# EAGLE schematic Durfee_Shutdown_Circuit_PCB_Design (EAGLE 9.7.0)
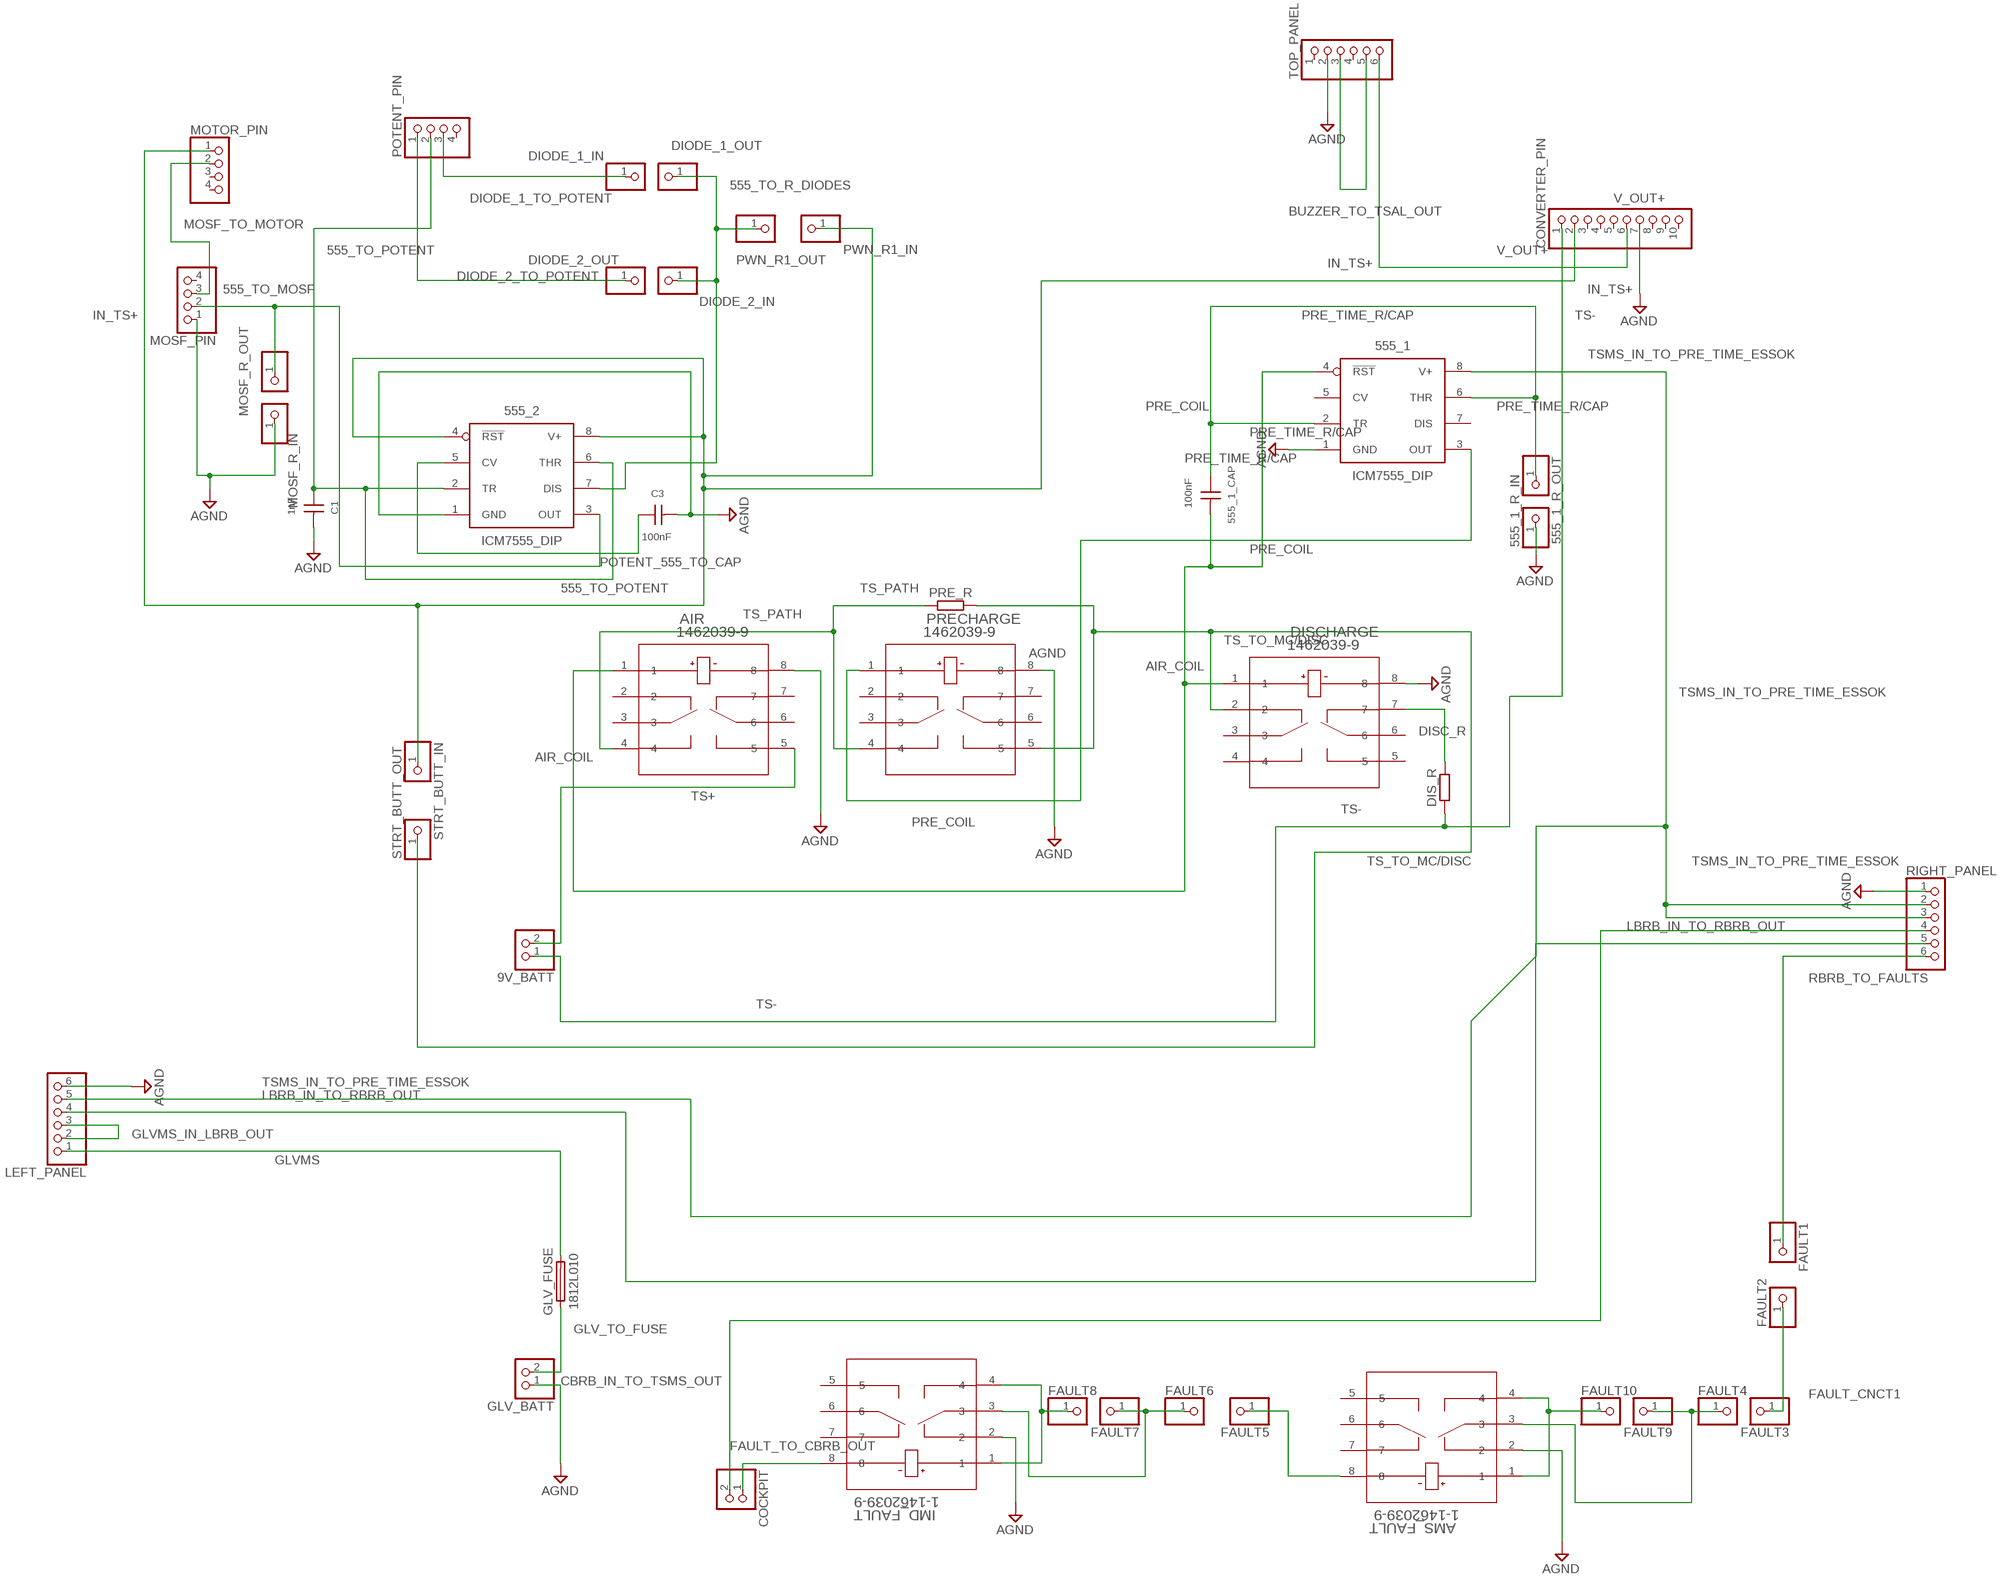
[diagram p0: schematic, sheet 1]

## Parts
9V_BATT  PINHD-1X2  [1X02]
555_1  ICM7555_DIP  [DIP826W53P254L959H508Q8B]
555_1_CAP  100nF  WCAP-CSGP_0603_885012206071_25V(DC)_R  [WCAP-CSGP_0603_R]
555_1_R_IN  PINHD-1X1  [1X01]
555_1_R_OUT  PINHD-1X1  [1X01]
555_2  ICM7555_DIP  [DIP826W53P254L959H508Q8B]
AIR  1462039-9  [RELAY8_SMTGUL]
AMS_FAULT  1-1462039-9  [RELAY8_SMTGUL]
C1  1nF  WCAP-CSGP_0402_885012205044_25V(DC)  [WCAP-CSGP_0402]
C3  100nF  WCAP-CSGP_0603_885012206071_25V(DC)_R  [WCAP-CSGP_0603_R]
COCKPIT  PINHD-1X2  [1X02]
CONVERTER_PIN  PINHD-1X10  [1X10]
DIODE_1_IN  PINHD-1X1  [1X01]
DIODE_1_OUT  PINHD-1X1  [1X01]
DIODE_2_IN  PINHD-1X1  [1X01]
DIODE_2_OUT  PINHD-1X1  [1X01]
DIS_R  R_AXIAL-7.2MM-PITCH  [RESAD724W46L381D178B]
DISCHARGE  1462039-9  [RELAY8_SMTGUL]
FAULT1  PINHD-1X1  [1X01]
FAULT2  PINHD-1X1  [1X01]
FAULT3  PINHD-1X1  [1X01]
FAULT4  PINHD-1X1  [1X01]
FAULT5  PINHD-1X1  [1X01]
FAULT6  PINHD-1X1  [1X01]
FAULT7  PINHD-1X1  [1X01]
FAULT8  PINHD-1X1  [1X01]
FAULT9  PINHD-1X1  [1X01]
FAULT10  PINHD-1X1  [1X01]
GLV_BATT  PINHD-1X2  [1X02]
GLV_FUSE  1812L010  [FUSC4532X125]
IMD_FAULT  1-1462039-9  [RELAY8_SMTGUL]
LEFT_PANEL  PINHD-1X6  [1X06]
MOSF_PIN  PINHD-1X4  [1X04]
MOSF_R_IN  PINHD-1X1  [1X01]
MOSF_R_OUT  PINHD-1X1  [1X01]
MOTOR_PIN  PINHD-1X4  [1X04]
POTENT_PIN  PINHD-1X4  [1X04]
PRE_R  R_AXIAL-7.2MM-PITCH  [RESAD724W46L381D178B]
PRECHARGE  1462039-9  [RELAY8_SMTGUL]
PWN_R1_IN  PINHD-1X1  [1X01]
PWN_R1_OUT  PINHD-1X1  [1X01]
RIGHT_PANEL  PINHD-1X6  [1X06]
STRT_BUTT_IN  PINHD-1X1  [1X01]
STRT_BUTT_OUT  PINHD-1X1  [1X01]
TOP_PANEL  PINHD-1X6  [1X06]

## Nets
555_TO_MOSF: 555_2.3(OUT) MOSF_PIN.2 MOSF_R_OUT.1
555_TO_POTENT: 555_2.2(TR) 555_2.6(THR) C1.1 POTENT_PIN.2
555_TO_R_DIODES: 555_2.7(DIS) DIODE_1_OUT.1 DIODE_2_IN.1 PWN_R1_OUT.1
AGND: 555_1.1(GND) 555_1_R_IN.1 555_2.1(GND) AIR.8 AMS_FAULT.2 C1.2 C3.2 CONVERTER_PIN.7 DISCHARGE.8 GLV_BATT.1 IMD_FAULT.2 LEFT_PANEL.6 MOSF_PIN.1 MOSF_R_IN.1 PRECHARGE.8 RIGHT_PANEL.1 TOP_PANEL.2
AIR_COIL: 555_1.4(!RST) 555_1_CAP.2 AIR.1 DISCHARGE.1
BUZZER_TO_TSAL_OUT: TOP_PANEL.3 TOP_PANEL.5
CBRB_IN_TO_TSMS_OUT: COCKPIT.2 RIGHT_PANEL.4
DIODE_1_TO_POTENT: DIODE_1_IN.1 POTENT_PIN.3
DIODE_2_TO_POTENT: DIODE_2_OUT.1 POTENT_PIN.1
DISC_R: DIS_R.2 DISCHARGE.7
FAULT_CNCT1: FAULT2.1 FAULT3.1
FAULT_TO_CBRB_OUT: COCKPIT.1 IMD_FAULT.8
GLV_TO_FUSE: GLV_BATT.2 GLV_FUSE.1
GLVMS: GLV_FUSE.2 LEFT_PANEL.1
GLVMS_IN_LBRB_OUT: LEFT_PANEL.2 LEFT_PANEL.3
IN_TS+: 555_2.4(!RST) 555_2.8(V+) CONVERTER_PIN.2 MOTOR_PIN.1 PWN_R1_IN.1 STRT_BUTT_IN.1
LBRB_IN_TO_RBRB_OUT: LEFT_PANEL.4 RIGHT_PANEL.5
MOSF_TO_MOTOR: MOSF_PIN.3 MOTOR_PIN.2
N$1: FAULT8.1 IMD_FAULT.1 IMD_FAULT.4
N$2: AMS_FAULT.3 FAULT4.1 FAULT9.1
N$3: FAULT6.1 FAULT7.1 IMD_FAULT.3
N$5: AMS_FAULT.8 FAULT5.1
N$6: AMS_FAULT.1 AMS_FAULT.4 FAULT10.1
POTENT_555_TO_CAP: 555_2.5(CV) C3.1
PRE_COIL: 555_1.3(OUT) PRECHARGE.1
PRE_TIME_R/CAP: 555_1.2(TR) 555_1.6(THR) 555_1_CAP.1 555_1_R_OUT.1
RBRB_TO_FAULTS: FAULT1.1 RIGHT_PANEL.6
TS+: 9V_BATT.2 AIR.5
TS-: 9V_BATT.1 CONVERTER_PIN.1 DIS_R.1
TS_PATH: AIR.4 PRE_R.1 PRECHARGE.4
TS_TO_MC/DISC: DISCHARGE.2 PRE_R.2 PRECHARGE.5 STRT_BUTT_OUT.1
TSMS_IN_TO_PRE_TIME_ESSOK: 555_1.8(V+) LEFT_PANEL.5 RIGHT_PANEL.2 RIGHT_PANEL.3
V_OUT+: CONVERTER_PIN.6 TOP_PANEL.6
Unconnected: 555_1.5(CV) 555_1.7(DIS) AIR.2 AIR.3 AIR.6 AIR.7 AMS_FAULT.5 AMS_FAULT.6 AMS_FAULT.7 CONVERTER_PIN.3 CONVERTER_PIN.4 CONVERTER_PIN.5 CONVERTER_PIN.8 CONVERTER_PIN.9 CONVERTER_PIN.10 DISCHARGE.3 DISCHARGE.4 DISCHARGE.5 DISCHARGE.6 IMD_FAULT.5 IMD_FAULT.6 IMD_FAULT.7 MOSF_PIN.4 MOTOR_PIN.3 MOTOR_PIN.4 POTENT_PIN.4 PRECHARGE.2 PRECHARGE.3 PRECHARGE.6 PRECHARGE.7 TOP_PANEL.1 TOP_PANEL.4

## Library data of the parts
9V_BATT COCKPIT GLV_BATT = pinhead:PINHD-1X2: PIN HEADER
555_1 555_2 = IC_Clock-Timing:*555: TIMER 555 General purpose precision timers NE555 : Texas Datasheet <http://www.ti.com/general/docs/suppproductinfo.tsp?distId=10&gotoUrl=http%3A%2F%2Fwww.ti.com%2Flit%2Fgpn%2Fne555>, Diodes Incorporated Datasheet <https://www.diodes.com/assets/Datasheets/NE555_SA555_NA555.pdf> LM555 Datasheet <http://www.ti.com/general/docs/suppproductinfo.tsp?distId=10&gotoUrl=http%3A%2F%2Fwww.ti.com%2Flit%2Fgpn%2Flm555> LMC555 Datasheet <http://www.ti.com/general/docs/suppproductinfo.tsp?distId=10&gotoUrl=http%3A%2F%2Fwww.ti.com%2Flit%2Fgpn%2Flmc555> ICM7555 : Maxim Integrated Datasheet <https://datasheets.maximintegrated.com/en/ds/ICM7555-ICM7556.pdf>, Renesas Electronics America Inc Datasheet <https://www.renesas.com/en-us/www/doc/datasheet/icm7555-56.pdf>; CATEGORY: IC_Clock-Timing; CURRENT-SUPPLY: 60µA; DESCRIPTION: IC OSC SINGLE TIMER 1MHZ 8DIP; FREQUENCY: 1MHz; MANUFACTURER: Renesas Electronics America Inc; MPN: ICM7555IPAZ; OPERATING_TEMP: -25°C to 85°C; PART_STATUS: Active; ROHS_COMPLIANT: ROHS3 Compliant; SUB-CATEGORY: Timer
555_1_CAP C3 = Wurth_Capacitors_WCAP-CSGP:WCAP-CSGP_0603: WCAP-CSGP MLCCs 0603 General Purpose Characteristics General purpose product series High performance ceramic High electrical precision and stability ceramic especially for NP0 Minimal aging especially for NP0 Mounting style: SMT-Chip Ceramic: NP0 (Class I), X5R (Class II), X7R (Class II) Temperature coefficient: ±30 ppm/°C; ±0.54 % for NP0 ±15 % for X5R and X7R Operating temperature: -55 °C up to + 125 °C for NP0 and X7R -55 °C up to + 85 °C for X5R Termination: Cu/Ni/Sn Recommended soldering: Reflow soldering Wave soldering for size 0603 Wave soldering for size 0805 (only valid for the thickness ≤0.85 mm) Applications Temperature compensation (NP0) Coupling Decoupling Bypass Smoothing Filtering Resonant circuit <https://www.we-online.com/catalog/media/o177837v209%20MLCC_GRP_all.jpg> Details see: https://www.we-online.com/catalog/en/pbs/capacitors/multilayer_ceramic_chip_capacitors/mlcc_general_purpose Updated by Ella Wu 2022-06-20 2022(C) Würth Elektronik; CERAMIC-TYPE: X7R Class II; DATASHEET-URL: https://www.we-online.com/redexpert/spec/885012206071?ae; DF: 3.5%; HEIGHT: 0.8mm; MOUNT: SMT; OPERATING-TEMPERATURE: -55 up to +125 °C; PART-NUMBER: 885012206071; QMIN: -; RISO: 5GOhm; SIZE: 0603; TECHNICAL-REFERENCE: X7R0603104K025DFCT10000; VR: 25V(DC)
555_1_R_IN 555_1_R_OUT DIODE_1_IN DIODE_1_OUT DIODE_2_IN DIODE_2_OUT FAULT1-FAULT10 MOSF_R_IN MOSF_R_OUT PWN_R1_IN PWN_R1_OUT STRT_BUTT_IN STRT_BUTT_OUT = pinhead:PINHD-1X1: PIN HEADER
AIR DISCHARGE PRECHARGE = Relays:1462039-9; BUILT_BY: EMA_UL_Team; CATEGORY: Signal Relays; COPYRIGHT: Copyright (C) 2016 Accelerated Designs. All rights reserved; DESCRIPTION: IM48DGR=IM RELAY 100 MW 2.4 V; MANUFACTURER_PART_NUMBER: 1462039-9; PART_STATUS: active; SERIES: Axicom IM; VENDOR: TE Connectivity
AMS_FAULT IMD_FAULT = Relays:1-1462039-9; BUILT_BY: EMA_UL_Team; CATEGORY: Signal Relays; CONTACT_ARRANGEMENT: 2 Form C (CO); COPYRIGHT: Copyright (C) 2016 Accelerated Designs. All rights reserved; DESCRIPTION: IM42DGR=IM RELAY 100 MW 4.5 V; MANUFACTURER_PART_NUMBER: 1-1462039-9; MAXIMUM_SWITCHING_CURRENT: -; MAXIMUM_SWITCHING_VOLTAGE: -; PART_STATUS: active; PRODUCT_TYPE: Relay; RELAY_TYPE: IM Relay; SERIES: Axicom IM; TE_PART_NUMBER: 1-1462039-9; VENDOR: TE Connectivity
C1 = Wurth_Capacitors_WCAP-CSGP:WCAP-CSGP_0402: WCAP-CSGP MLCCs 0402 General Purpose Characteristics General purpose product series High performance ceramic High electrical precision and stability ceramic especially for NP0 Minimal aging especially for NP0 Mounting style: SMT-Chip Ceramic: NP0 (Class I), X5R (Class II), X7R (Class II) Temperature coefficient: ±30 ppm/°C; ±0.54 % for NP0 ±15 % for X5R and X7R Operating temperature: -55 °C up to + 125 °C for NP0 and X7R -55 °C up to + 85 °C for X5R Termination: Cu/Ni/Sn Recommended soldering: Reflow soldering Wave soldering for size 0603 Wave soldering for size 0805 (only valid for the thickness ≤0.85 mm) Applications Temperature compensation (NP0) Coupling Decoupling Bypass Smoothing Filtering Resonant circuit <https://www.we-online.com/catalog/media/o177837v209%20MLCC_GRP_all.jpg> Details see: https://www.we-online.com/catalog/en/pbs/capacitors/multilayer_ceramic_chip_capacitors/mlcc_general_purpose Updated by Ella Wu 2022-02-15 2022(C) Würth Elektronik; CERAMIC-TYPE: X7R Class II; DATASHEET-URL: https://www.we-online.com/redexpert/spec/885012205044?ae; DF: 3.5%; HEIGHT: 0.5mm; MOUNT: SMT; OPERATING-TEMPERATURE: -55 up to +125 °C; PART-NUMBER: 885012205044; QMIN: -; RISO: 10GOhm; SIZE: 0402; TECHNICAL-REFERENCE: X7R0402102K025DFCT10000; VR: 25V(DC)
CONVERTER_PIN = pinhead:PINHD-1X10: PIN HEADER
DIS_R PRE_R = Resistor:R: Resistor Fixed - Generic; CATEGORY: Resistor; SUB-CATEGORY: Fixed
GLV_FUSE = Fuse:1812L: 1812L Series PTC provides surface mount overcurrent protection for applications where resettable protection is desired. Datasheet <https://www.littelfuse.com/~/media/electronics/datasheets/resettable_ptcs/littelfuse_ptc_1812l_datasheet.pdf.pdf>; CATEGORY: FUSE; DESCRIPTION: Resettable PTCs; MANUFACTURER: Littlefuse; MPN: 1812L010; OPERATING_TEMPERATURE: -40°C to +85°C; PART_STATUS: ACTIVE; ROHS_COMPLIANCE: RoHS Compliant; SERIES: 1812L; SUBCATEGORY: Resettable; TYPE: PTC
LEFT_PANEL RIGHT_PANEL TOP_PANEL = pinhead:PINHD-1X6: PIN HEADER
MOSF_PIN MOTOR_PIN POTENT_PIN = pinhead:PINHD-1X4: PIN HEADER

## Net classes
0 default: width 0.953 mm